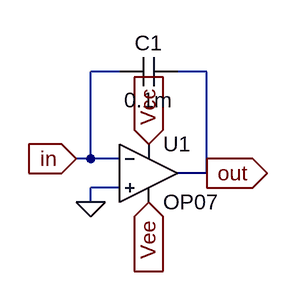
[diagram p0: schematic inte1.asc]
inte1.asc, the LTspice schematic file:
Version 4.1
SHEET 1 880 680
WIRE 240 80 208 80
WIRE 336 80 304 80
WIRE 208 176 208 80
WIRE 208 176 192 176
WIRE 240 176 208 176
WIRE 336 192 336 80
WIRE 336 192 304 192
WIRE 240 208 208 208
WIRE 208 224 208 208
FLAG 208 224 0
FLAG 272 160 Vcc
IOPIN 272 160 In
FLAG 272 224 Vee
IOPIN 272 224 In
FLAG 336 192 out
IOPIN 336 192 Out
FLAG 192 176 in
IOPIN 192 176 In
SYMBOL OpAmps\\OP07 272 128 R0
SYMATTR InstName U1
SYMBOL cap 304 64 R90
WINDOW 0 0 32 VBottom 2
WINDOW 3 32 32 VTop 2
SYMATTR InstName C1
SYMATTR Value 0.1m

The netlist it stands for:
* inte1.asc
X§U1 0 in Vcc Vee out LT1001  ; OP07, pins In+ In- V+ V- OUT
C1 out in 0.1m
.lib LTC.lib
.backanno
.end